# EAGLE design Remote (EAGLE 9.4.2)

## Sheet 1 of 3
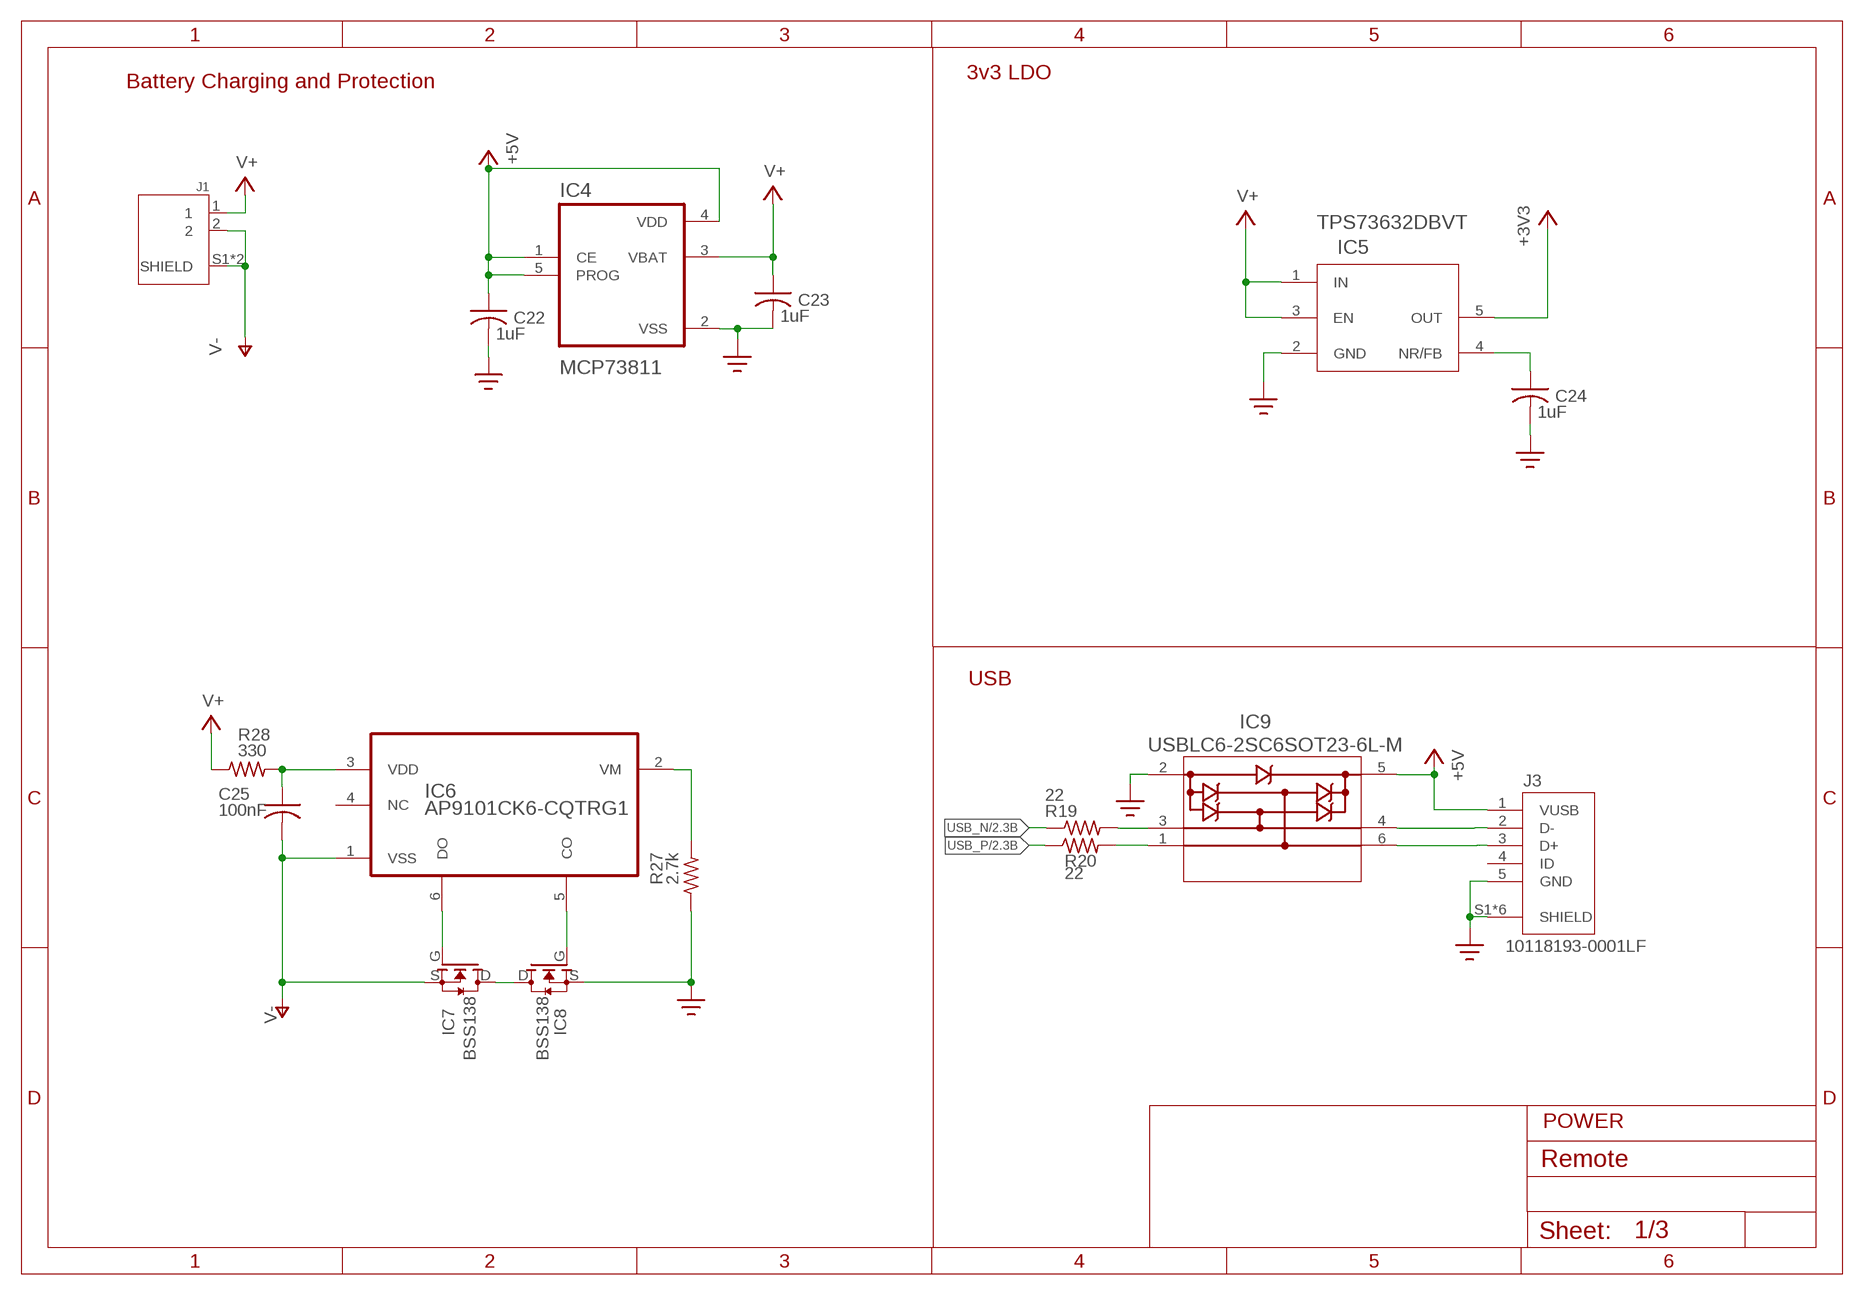
[diagram p0: schematic, sheet 1]

### Parts
C22  1uF  C-USC0805K  [C0805K]
C23  1uF  C-USC0805K  [C0805K]
C24  1uF  C-USC0805K  [C0805K]
C25  100nF  C-USC0805K  [C0805K]
IC4  MCP73811  MCP73811T-420I/OT  [SOT95P280X145-5N]
IC5  TPS73632DBVT  TPS73632DBVTDBV5-M  [DBV5-M]
IC6  AP9101CK6-CQTRG1  [SOT95P280X140-6N]
IC7  BSS138  [BSS138]
IC8  BSS138  [BSS138]
IC9  USBLC6-2SC6SOT23-6L-M  [SOT23-6L-M]
J1  S2B-PH-SM4-TB(LF)(SN)  [JST_S2B-PH-SM4-TB(LF)(SN)]
J3  10118193-0001LF  [FCI_10118193-0001LF]
R19  22  R-US_R0805W  [R0805W]
R20  22  R-US_R0805W  [R0805W]
R27  2.7k  R-US_R0805W  [R0805W]
R28  330  R-US_R0805W  [R0805W]

### Nets
+3V3 [Power]: IC5.5(OUT) ; also sheet 2,3
+5V [Power]: C22.1 IC4.1(CE) IC4.4(VDD) IC4.5(PROG) IC9.5(VBUS) J3.1(VUSB) ; also sheet 2
GND [Power]: C22.2 C23.2 C24.2 IC4.2(VSS) IC5.2(GND) IC8.S IC9.2(GND) J3.5(GND) J3.S1(SHIELD) J3.S2(SHIELD) J3.S3(SHIELD) J3.S4(SHIELD) J3.S5(SHIELD) J3.S6(SHIELD) R27.1 ; also sheet 2,3
N$29: IC6.6(DO) IC7.G
N$30: IC6.5(CO) IC8.G
N$31: IC7.D IC8.D
N$32: C24.1 IC5.4(NR/FB)
N$33: IC6.2(VM) R27.2
N$35: C25.1 IC6.3(VDD) R28.2
USB2_N [Differential]: IC9.4(I/O2) J3.2(D-)
USB2_P [Differential]: IC9.6(I/O1) J3.3(D+)
USB3_N [Differential]: IC9.3(I/O2_2) R19.2
USB3_P [Differential]: IC9.1(I/O1_2) R20.2
USB_N [Differential]: R19.1 ; also sheet 2
USB_P [Differential]: R20.1 ; also sheet 2
V+ [Power]: C23.1 IC4.3(VBAT) IC5.1(IN) IC5.3(EN) J1.1 R28.1 ; also sheet 2
V- [Power]: C25.2 IC6.1(VSS) IC7.S J1.2 J1.S1(SHIELD) J1.S2(SHIELD)
Unconnected: IC6.4(NC) J3.4(ID)

### Notes on the sheet
- 3v3 LDO
- Battery Charging and Protection
- USB
- POWER

## Sheet 2 of 3
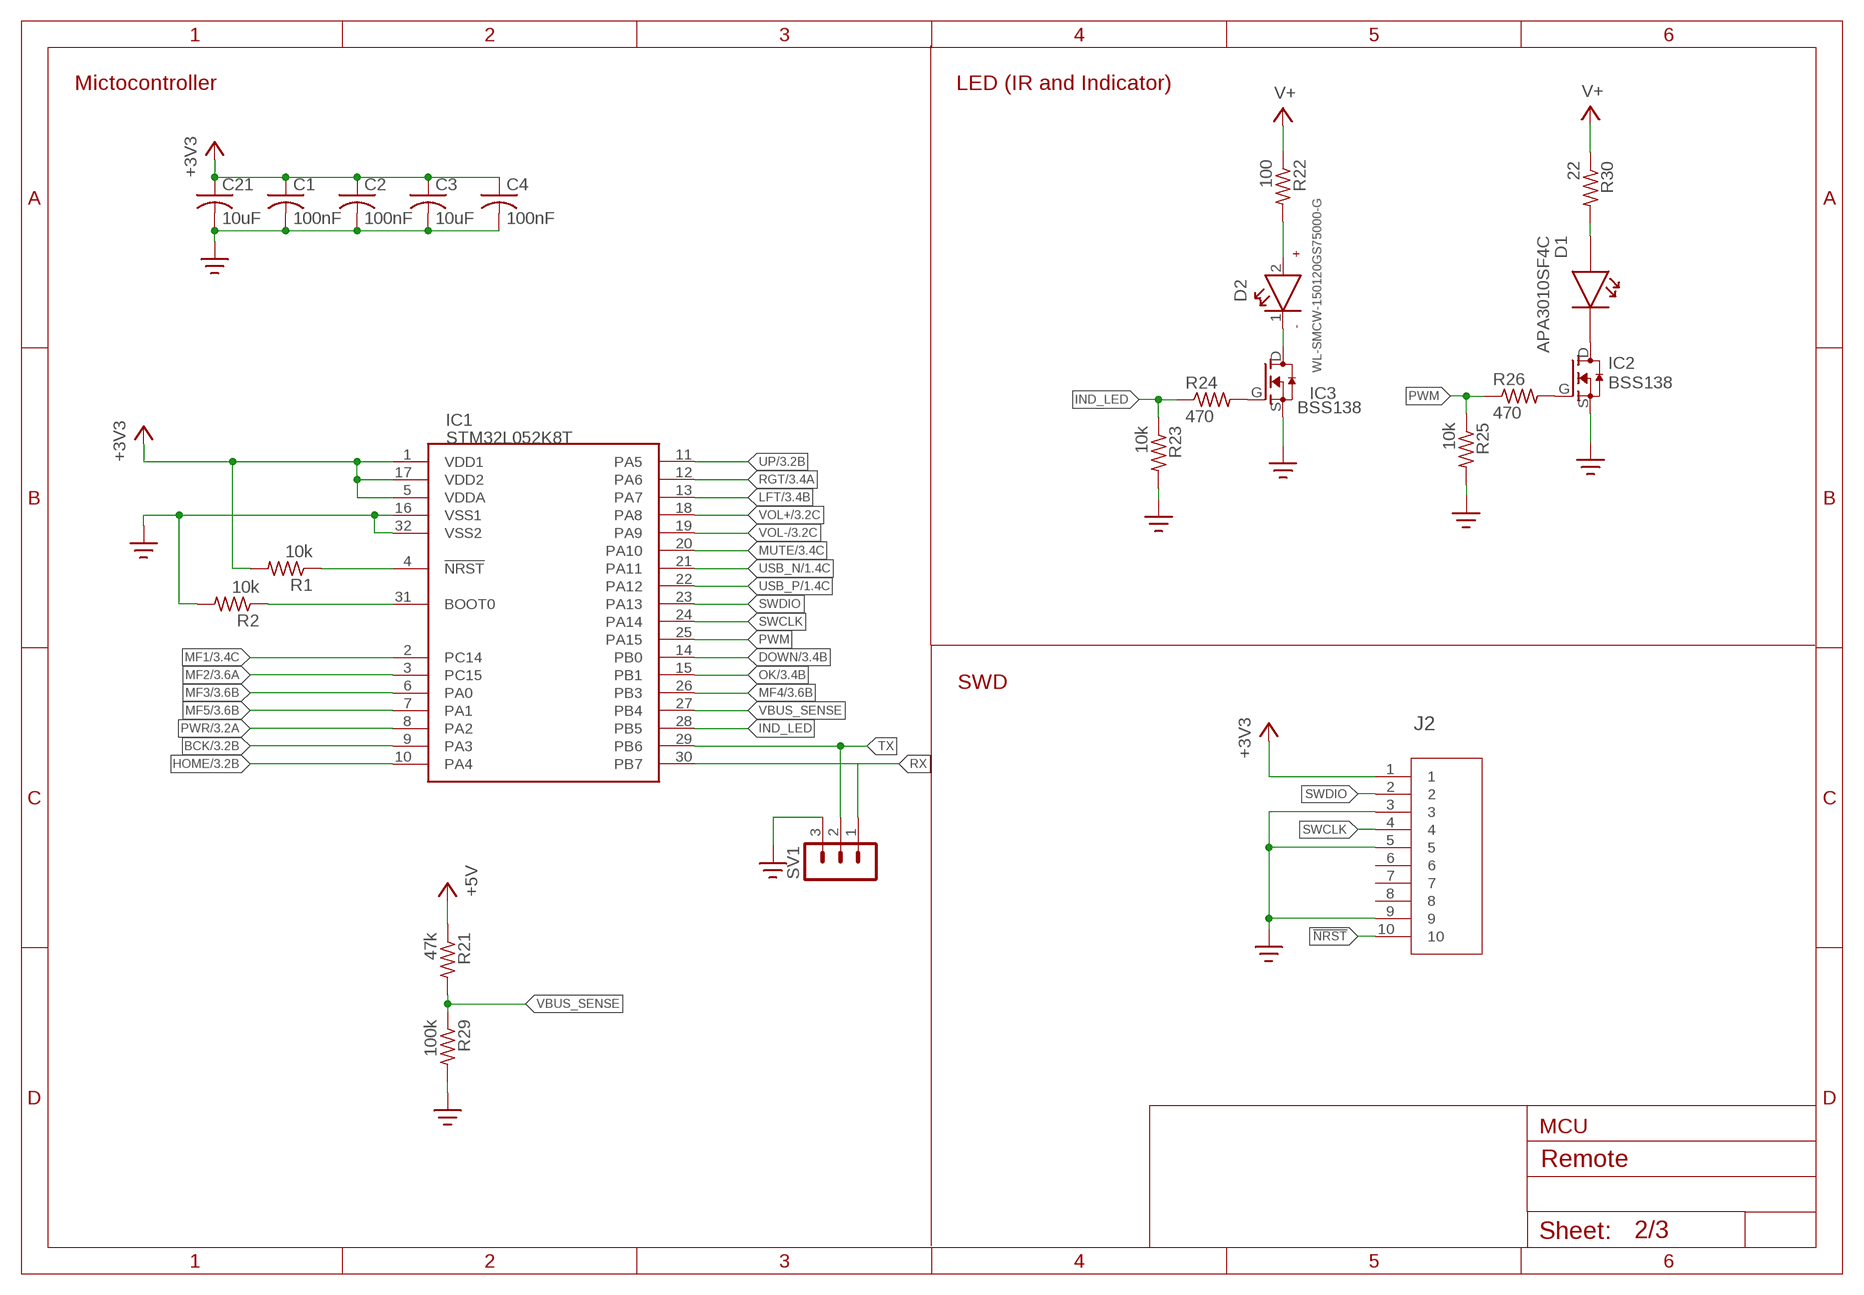
[diagram p1: schematic, sheet 2]

### Parts
C1  100nF  C-USC0805K  [C0805K]
C2  100nF  C-USC0805K  [C0805K]
C3  10uF  C-USC0805K  [C0805K]
C4  100nF  C-USC0805K  [C0805K]
C21  10uF  C-USC0805K  [C0805K]
D1  APA3010SF4C  [APA3010SF4C]
D2  WL-SMCW-150120GS75000-G  [WL-SMCW_1206]
IC1  STM32L052K8T  [QFP80P900X900X160-32N]
IC2  BSS138  [BSS138]
IC3  BSS138  [BSS138]
J2  20021121-00010C4LF  [CONN_00010C4LF_AMP]
R1  10k  R-US_R0805W  [R0805W]
R2  10k  R-US_R0805W  [R0805W]
R21  47k  R-US_R0805W  [R0805W]
R22  100  R-US_R0805W  [R0805W]
R23  10k  R-US_R0805W  [R0805W]
R24  470  R-US_R0805W  [R0805W]
R25  10k  R-US_R0805W  [R0805W]
R26  470  R-US_R0805W  [R0805W]
R29  100k  R-US_R0805W  [R0805W]
R30  22  R-US_R0805W  [R0805W]
SV1  MA03-1  [MA03-1]

### Nets
!NRST: IC1.4(!NRST) J2.10 R1.1
+3V3 [Power]: C1.1 C2.1 C3.1 C4.1 C21.1 IC1.1(VDD1) IC1.5(VDDA) IC1.17(VDD2) J2.1 R1.2 ; also sheet 1,3
+5V [Power]: R21.1 ; also sheet 1
BCK: IC1.9(PA3) ; also sheet 3
DOWN: IC1.14(PB0) ; also sheet 3
GND [Power]: C1.2 C2.2 C3.2 C4.2 C21.2 IC1.16(VSS1) IC1.32(VSS2) IC2.S IC3.S J2.3 J2.5 J2.9 R2.2 R23.2 R25.2 R29.2 SV1.3 ; also sheet 1,3
HOME: IC1.10(PA4) ; also sheet 3
IND_LED: IC1.28(PB5) R23.1 R24.1
LFT: IC1.13(PA7) ; also sheet 3
MF1: IC1.2(PC14) ; also sheet 3
MF2: IC1.3(PC15) ; also sheet 3
MF3: IC1.6(PA0) ; also sheet 3
MF4: IC1.26(PB3) ; also sheet 3
MF5: IC1.7(PA1) ; also sheet 3
MUTE: IC1.20(PA10) ; also sheet 3
N$2: D1.1 R30.2
N$3: IC1.31(BOOT0) R2.1
N$19: D1.2 IC2.D
N$23: D2.2(+) R22.2
N$24: D2.1(-) IC3.D
N$25: IC2.G R26.2
N$27: IC3.G R24.2
OK: IC1.15(PB1) ; also sheet 3
PWM: IC1.25(PA15) R25.1 R26.1
PWR: IC1.8(PA2) ; also sheet 3
RGT: IC1.12(PA6) ; also sheet 3
RX: IC1.30(PB7) SV1.1
SWCLK: IC1.24(PA14) J2.4
SWDIO: IC1.23(PA13) J2.2
TX: IC1.29(PB6) SV1.2
UP: IC1.11(PA5) ; also sheet 3
USB_N [Differential]: IC1.21(PA11) ; also sheet 1
USB_P [Differential]: IC1.22(PA12) ; also sheet 1
V+ [Power]: R22.1 R30.1 ; also sheet 1
VBUS_SENSE: IC1.27(PB4) R21.2 R29.1
VOL+: IC1.18(PA8) ; also sheet 3
VOL-: IC1.19(PA9) ; also sheet 3
Unconnected: J2.6 J2.7 J2.8

### Notes on the sheet
- Mictocontroller | LED (IR and Indicator)
- SWD
- MCU

## Sheet 3 of 3
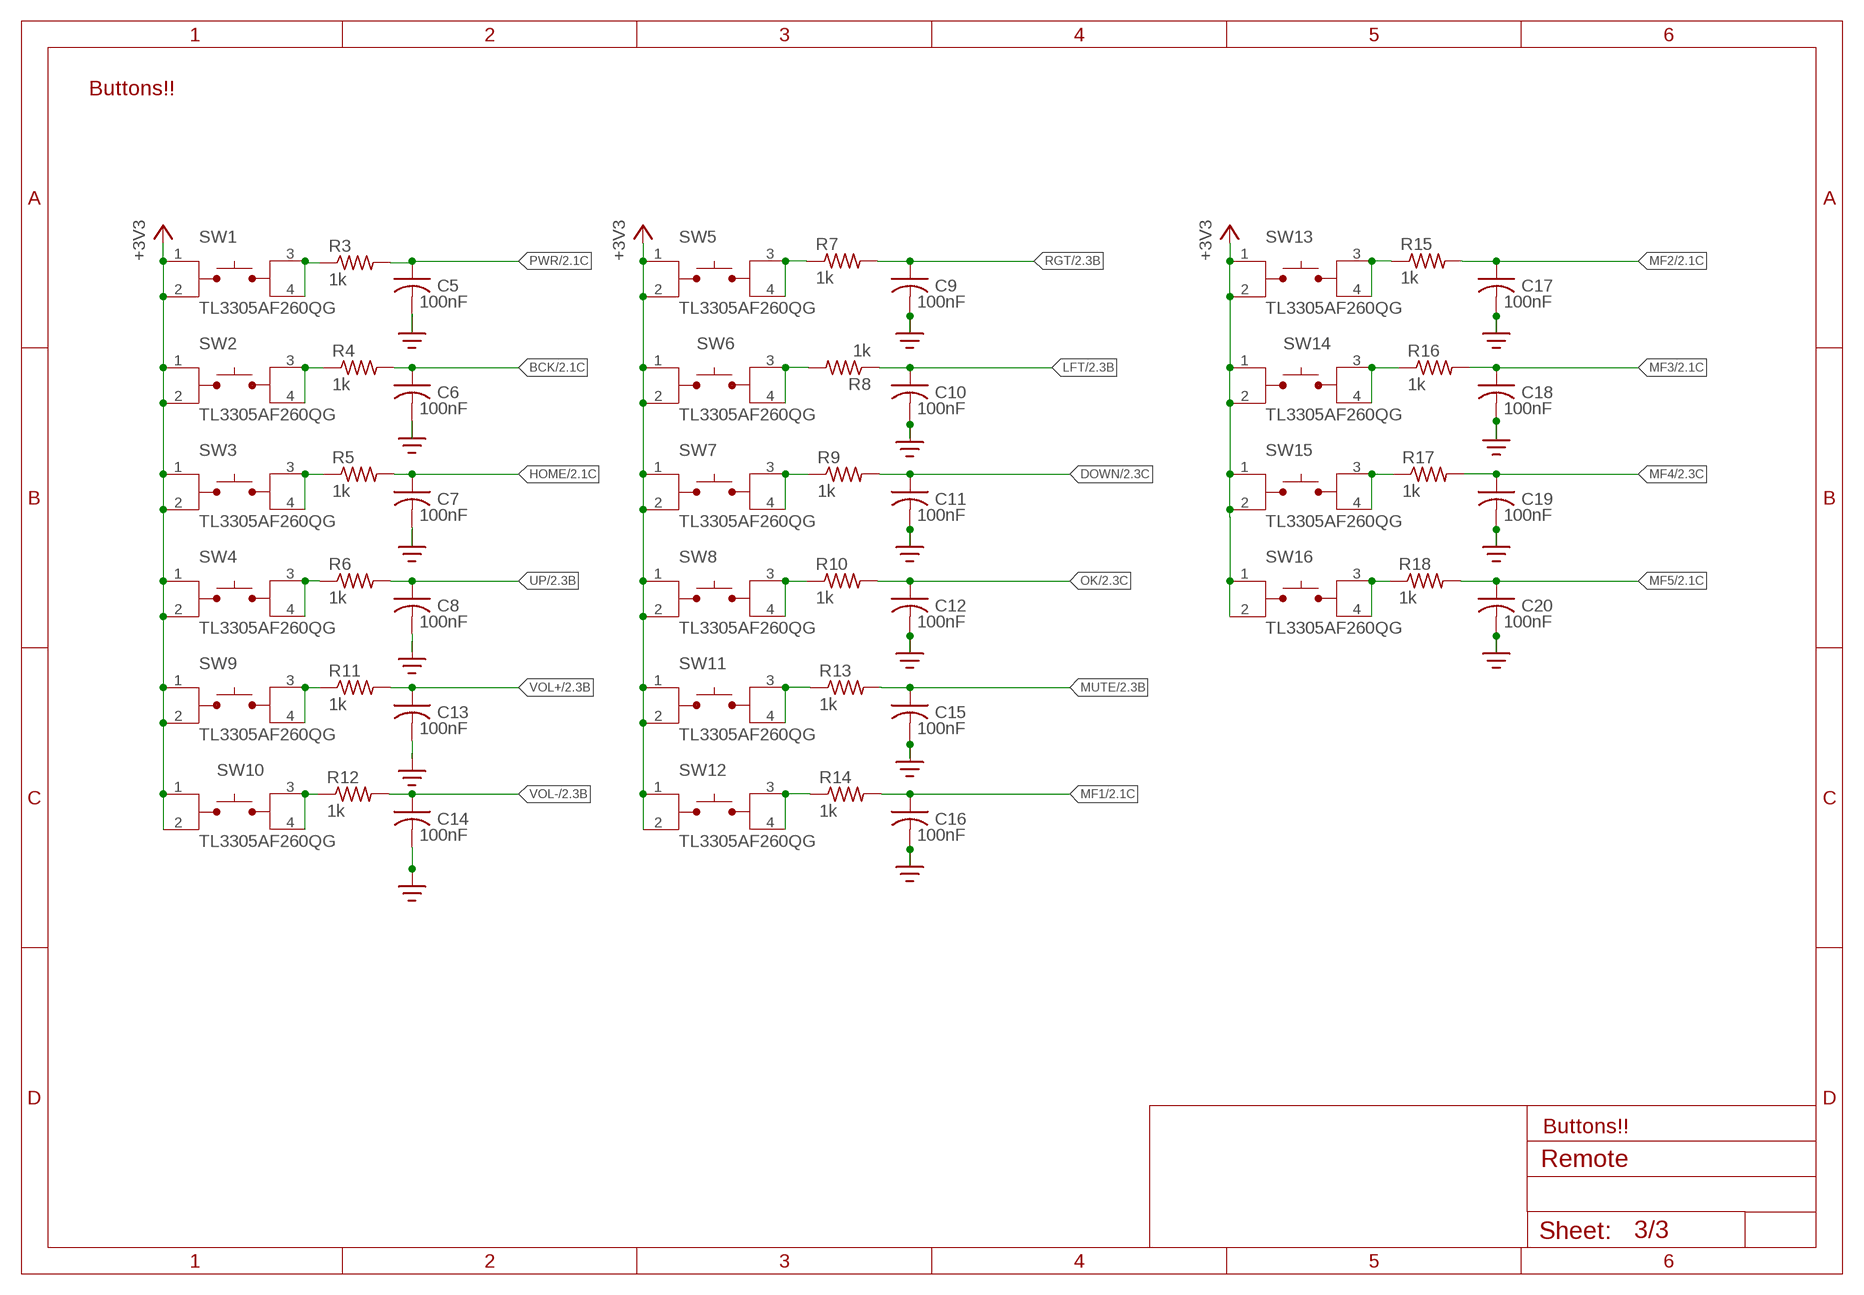
[diagram p2: schematic, sheet 3]

### Parts
C5  100nF  C-USC0805K  [C0805K]
C6  100nF  C-USC0805K  [C0805K]
C7  100nF  C-USC0805K  [C0805K]
C8  100nF  C-USC0805K  [C0805K]
C9  100nF  C-USC0805K  [C0805K]
C10  100nF  C-USC0805K  [C0805K]
C11  100nF  C-USC0805K  [C0805K]
C12  100nF  C-USC0805K  [C0805K]
C13  100nF  C-USC0805K  [C0805K]
C14  100nF  C-USC0805K  [C0805K]
C15  100nF  C-USC0805K  [C0805K]
C16  100nF  C-USC0805K  [C0805K]
C17  100nF  C-USC0805K  [C0805K]
C18  100nF  C-USC0805K  [C0805K]
C19  100nF  C-USC0805K  [C0805K]
C20  100nF  C-USC0805K  [C0805K]
R3  1k  R-US_R0805W  [R0805W]
R4  1k  R-US_R0805W  [R0805W]
R5  1k  R-US_R0805W  [R0805W]
R6  1k  R-US_R0805W  [R0805W]
R7  1k  R-US_R0805W  [R0805W]
R8  1k  R-US_R0805W  [R0805W]
R9  1k  R-US_R0805W  [R0805W]
R10  1k  R-US_R0805W  [R0805W]
R11  1k  R-US_R0805W  [R0805W]
R12  1k  R-US_R0805W  [R0805W]
R13  1k  R-US_R0805W  [R0805W]
R14  1k  R-US_R0805W  [R0805W]
R15  1k  R-US_R0805W  [R0805W]
R16  1k  R-US_R0805W  [R0805W]
R17  1k  R-US_R0805W  [R0805W]
R18  1k  R-US_R0805W  [R0805W]
SW1  TL3305AF260QG  [SW_TL3305AF260QG]
SW2  TL3305AF260QG  [SW_TL3305AF260QG]
SW3  TL3305AF260QG  [SW_TL3305AF260QG]
SW4  TL3305AF260QG  [SW_TL3305AF260QG]
SW5  TL3305AF260QG  [SW_TL3305AF260QG]
SW6  TL3305AF260QG  [SW_TL3305AF260QG]
SW7  TL3305AF260QG  [SW_TL3305AF260QG]
SW8  TL3305AF260QG  [SW_TL3305AF260QG]
SW9  TL3305AF260QG  [SW_TL3305AF260QG]
SW10  TL3305AF260QG  [SW_TL3305AF260QG]
SW11  TL3305AF260QG  [SW_TL3305AF260QG]
SW12  TL3305AF260QG  [SW_TL3305AF260QG]
SW13  TL3305AF260QG  [SW_TL3305AF260QG]
SW14  TL3305AF260QG  [SW_TL3305AF260QG]
SW15  TL3305AF260QG  [SW_TL3305AF260QG]
SW16  TL3305AF260QG  [SW_TL3305AF260QG]

### Nets
+3V3 [Power]: SW1.1 SW1.2 SW2.1 SW2.2 SW3.1 SW3.2 SW4.1 SW4.2 SW5.1 SW5.2 SW6.1 SW6.2 SW7.1 SW7.2 SW8.1 SW8.2 SW9.1 SW9.2 SW10.1 SW10.2 SW11.1 SW11.2 SW12.1 SW12.2 SW13.1 SW13.2 SW14.1 SW14.2 SW15.1 SW15.2 SW16.1 SW16.2 ; also sheet 1,2
BCK: C6.1 R4.2 ; also sheet 2
DOWN: C11.1 R9.2 ; also sheet 2
GND [Power]: C5.2 C6.2 C7.2 C8.2 C9.2 C10.2 C11.2 C12.2 C13.2 C14.2 C15.2 C16.2 C17.2 C18.2 C19.2 C20.2 ; also sheet 1,2
HOME: C7.1 R5.2 ; also sheet 2
LFT: C10.1 R8.1 ; also sheet 2
MF1: C16.1 R14.2 ; also sheet 2
MF2: C17.1 R15.2 ; also sheet 2
MF3: C18.1 R16.2 ; also sheet 2
MF4: C19.1 R17.2 ; also sheet 2
MF5: C20.1 R18.2 ; also sheet 2
MUTE: C15.1 R13.2 ; also sheet 2
N$1: R3.1 SW1.3 SW1.4
N$4: R4.1 SW2.3 SW2.4
N$5: R5.1 SW3.3 SW3.4
N$6: R6.1 SW4.3 SW4.4
N$7: R11.1 SW9.3 SW9.4
N$8: R12.1 SW10.3 SW10.4
N$9: R7.1 SW5.3 SW5.4
N$10: R8.2 SW6.3 SW6.4
N$11: R9.1 SW7.3 SW7.4
N$12: R10.1 SW8.3 SW8.4
N$13: R13.1 SW11.3 SW11.4
N$14: R14.1 SW12.3 SW12.4
N$15: R15.1 SW13.3 SW13.4
N$16: R16.1 SW14.3 SW14.4
N$17: R17.1 SW15.3 SW15.4
N$18: R18.1 SW16.3 SW16.4
OK: C12.1 R10.2 ; also sheet 2
PWR: C5.1 R3.2 ; also sheet 2
RGT: C9.1 R7.2 ; also sheet 2
UP: C8.1 R6.2 ; also sheet 2
VOL+: C13.1 R11.2 ; also sheet 2
VOL-: C14.1 R12.2 ; also sheet 2

### Notes on the sheet
- Buttons!!
- Buttons!!

## Library data of the parts
C1-C25 = rcl:C-US: CAPACITOR, American symbol; SPICEPREFIX: C
D1 = APA3010SF4C:APA3010SF4C: DIO-10854 Right-angle 880nm SMT infrared LED; DESCRIPTION: Infrared _IR_ Emitter 880nm 1.3V 50mA 0.4mW/sr @ 20mA 120° 2-SMD, No Lead; DIGI-KEY_PART_NUMBER: 754-1070-1-ND; DIGI-KEY_PURCHASE_URL: https://www.digikey.com/product-detail/en/kingbright/APA3010SF4C/754-1070-1-ND/1747787?utm_source=snapeda&utm_medium=aggregator&utm_campaign=symbol; MF: Kingbright; MP: APA3010SF4C; PACKAGE: SMD-2 Kingbright
D2 = WL-SMCW:WL-SMCW: SMD mono-color Chip LED Characteristics Low energy consumption High reliability Low current requirement Fast switching No UV/IR radiation Smallest SMD package with exceptional brightness Top view Wide viewing angle PBC high-usage Applications Backlight for mobile and portable device keypads Indoor and outdoor message boards Flat backlight for LCDs, switches and symbols Display for industrial control systems and traffic Miniaturized color effects Pedestrian mark Optical indicators General lighting Toys <http://katalog.we-online.de/media/images/eipal/WL-SMCW_pf2.jpg> Details see: http://katalog.we-online.de/en/led/WL-SMCW?m Updated 2015-04-10 2015 (C) Wurth Elektronik; AVAILABILITY: Unavailable; DESCRIPTION: Green 570nm LED Indication - Discrete 2V 0603 _1608 Metric_; MF: Wurth Electronics; MP: 150060VS75000; PACKAGE: 0603 Wurth Electronics; PRICE: None
IC1 = QFP80P900X900X160-32N:STM32L052K8T
IC2 IC3 IC7 IC8 = BSS138:BSS138: BSS138 N-Channel Logic Level Enhancement Mode Field Effect Transistor; AVAILABILITY: Unavailable; DESCRIPTION: N-Channel 50V 220mA _Ta_ 360mW _Ta_ Surface Mount SOT-23-3; MF: MICROSS/On Semiconductor; MP: BSS138; PACKAGE: TO-236-3 Micross; PRICE: None
IC4 = MCP73811T-420I_OT:MCP73811T-420I/OT; DESCRIPTION: Charger IC Lithium Ion/Polymer SOT-23-5; DIGI-KEY_PART_NUMBER: MCP73811T-420I/OTCT-ND; DIGI-KEY_PURCHASE_URL: https://www.digikey.com/product-detail/en/microchip-technology/MCP73811T-420I-OT/MCP73811T-420I-OTCT-ND/1649474?utm_source=snapeda&utm_medium=aggregator&utm_campaign=symbol; MF: Microchip; MP: MCP73811T-420I/OT; PACKAGE: SOT-23 Microchip
IC5 = Remote:TPS73632DBVT; BUILT_BY: EMA_UL_Team; MANUFACTURER: Texas Instruments; MANUFACTURER_PART_NUMBER: TPS73632DBVT; VENDOR: Texas Instruments
IC6 = AP9101CK6-CQTRG1:AP9101CK6-CQTRG1: None; AVAILABILITY: Unavailable; DESCRIPTION: Battery Battery Protection IC Lithium Ion/Polymer SOT-26; MF: Diodes Inc.; MP: AP9101CK6-CQTRG1; PACKAGE: SOT-23 Diodes Inc.; PRICE: None
IC9 = Remote:USBLC6-2SC6; BUILT_BY: EMA_UL_Team; MANUFACTURER_PART_NUMBER: USBLC6-2SC6; VENDOR: STMicroelectronics
J1 = S2B-PH-SM4-TB_LF__SN_:S2B-PH-SM4-TB(LF)(SN): PH Series 2 Position 2 mm Pitch Surface Mount Side Entry Shrouded Header; AVAILABILITY: Unavailable; DESCRIPTION: Connector Header Surface Mount, Right Angle 2 position 0.079 _2.00mm_; MF: JST Sales; MP: S2B-PH-SM4-TB_LF__SN_; PACKAGE: None; PRICE: None
J2 = Remote:20021121-00010C4LF; BUILT_BY: EMA_Matt; COPYRIGHT: Copyright (C) 2018 Accelerated Designs. All rights reserved; MANUFACTURER_PART_NUMBER: 20021121-00010C4LF; SOURCELIBRARY: Amphenol_2019-10-30; VENDOR: Amphenol
J3 = 10118193-0001LF:10118193-0001LF: Micro USB B Type Receptacle; DESCRIPTION: USB - micro B USB 2.0 Receptacle Connector 5 Position Surface Mount, Right Angle; Through Hole; DIGI-KEY_PART_NUMBER: 609-4616-1-ND; DIGI-KEY_PURCHASE_URL: https://www.digikey.com/product-detail/en/amphenol-icc-fci/10118193-0001LF/609-4616-1-ND/2785380?utm_source=snapeda&utm_medium=aggregator&utm_campaign=symbol; MF: Amphenol ICC; MP: 10118193-0001LF; PACKAGE: None
R1-R30 = Controller:R-US_: RESISTOR, American symbol; SPICEPREFIX: R
SV1 = con-lstb:MA03-1: PIN HEADER; OC_FARNELL: unknown; OC_NEWARK: unknown
SW1-SW16 = TL3305AF260QG:TL3305AF260QG: Switch Tactile Spst-No 50ma 12v; DESCRIPTION: Tactile Switch SPST-NO Top Actuated Surface Mount; DIGI-KEY_PART_NUMBER: EG5353CT-ND; DIGI-KEY_PURCHASE_URL: https://www.digikey.com/product-detail/en/e-switch/TL3305AF260QG/EG5353CT-ND/5816198?utm_source=snapeda&utm_medium=aggregator&utm_campaign=symbol; MF: E-Switch; MP: TL3305AF260QG; PACKAGE: LQFP-48 E-Switch

## Net classes
1 Differential: width 0.406 mm, clearance 0.203 mm
2 Power: width 0.508 mm, clearance 0.203 mm

## Board
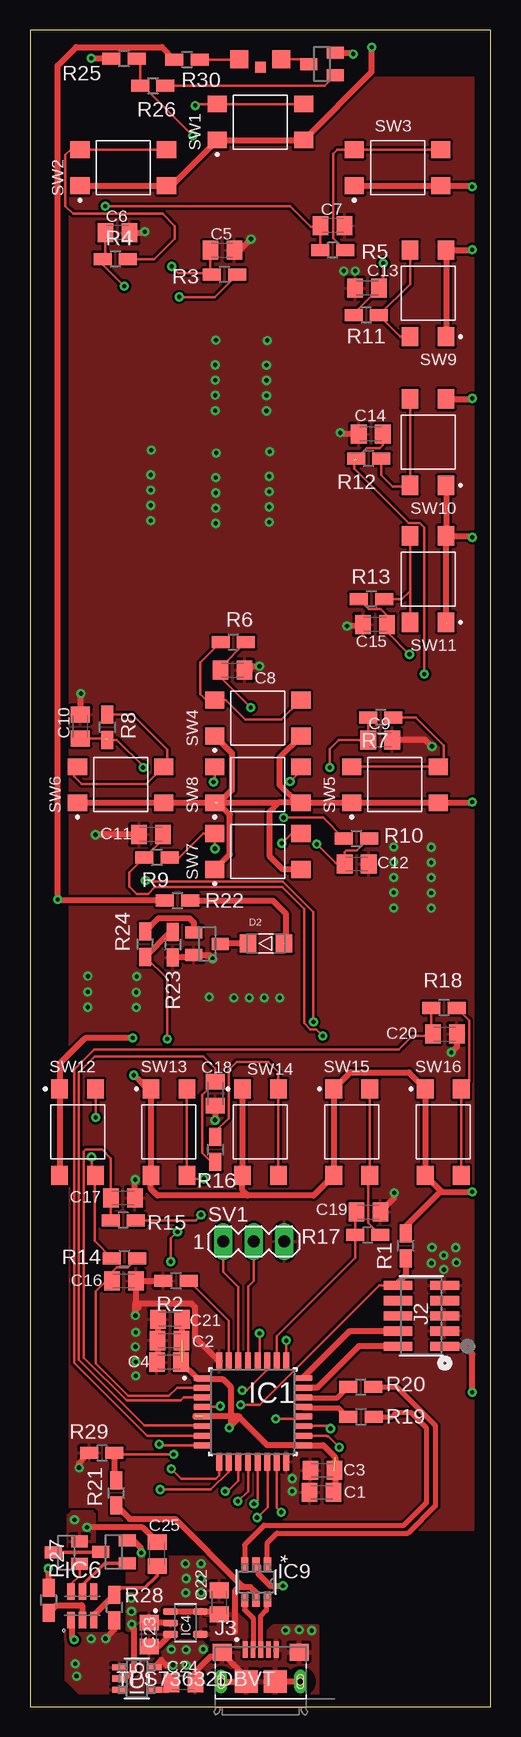
[diagram p3: board, top side]
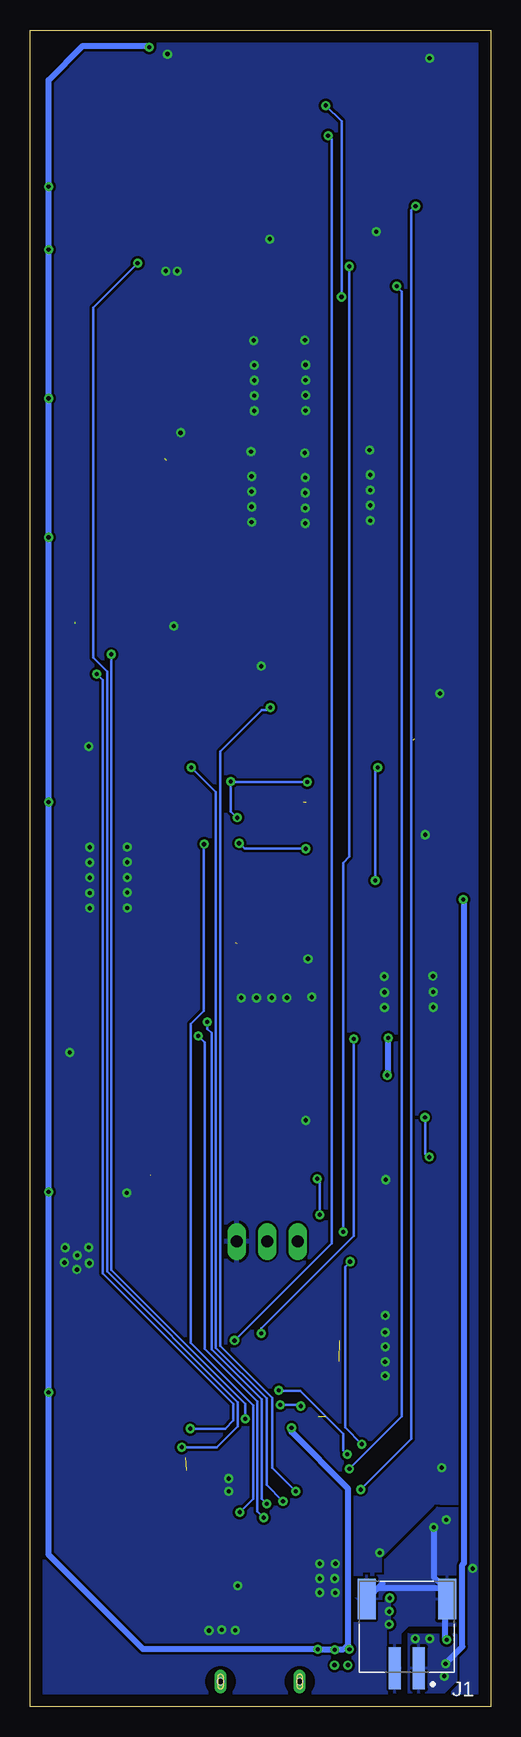
[diagram p4: board, bottom side, seen from below]

Size 38.4 x 139.78 mm. Coordinates in mm from the lower left corner, seen from the top.
Outline: 0.03,0 38.4,0.03 38.38,139.78 0,139.75 0.03,0
Copper layers (1*16): Top 0.035mm / dielectric 1.5mm / Bottom 0.035mm
Design rules "default": minimum track width 6mil, minimum drill 0.35mm, track to track 6mil, track to pad 6mil, pad to pad 6mil, via to via 6mil, smd to smd 6mil, copper to edge 40mil, drill to drill 6mil, minimum pad ring 10mil, minimum via ring 8mil, stop-mask expansion 4mil, vias tented up to drill 0mil, thermal gap 10mil

### Footprints (pad centres in the part's own frame; a part is rotated, then mirrored left to right if it is on the bottom)
C0805K = smd 1.3 x 1.6: 1 -1,0; 2 1,0
APA3010SF4C = smd 1.5 x 1.5: 1 0,-1.75; 2 0,1.75 | smd 0.9 x 0.9: 3 0.65,0
WL-SMCW_1206 = smd 1.4 x 1.5: 1 -1.5,0; 2 1.5,0
QFP80P900X900X160-32N = smd 1.56 x 0.55: 1 -4.18,2.8; 2 -4.18,2; 3 -4.18,1.2; 4 -4.18,0.4; 5 -4.18,-0.4; 6 -4.18,-1.2; 7 -4.18,-2; 8 -4.18,-2.8; 17 4.18,-2.8; 18 4.18,-2; 19 4.18,-1.2; 20 4.18,-0.4; 21 4.18,0.4; 22 4.18,1.2; 23 4.18,2; 24 4.18,2.8 | smd 0.55 x 1.56: 9 -2.8,-4.18; 10 -2,-4.18; 11 -1.2,-4.18; 12 -0.4,-4.18; 13 0.4,-4.18; 14 1.2,-4.18; 15 2,-4.18; 16 2.8,-4.18; 25 2.8,4.18; 26 2,4.18; 27 1.2,4.18; 28 0.4,4.18; 29 -0.4,4.18; 30 -1.2,4.18; 31 -2,4.18; 32 -2.8,4.18
BSS138 = smd 1 x 1.4: D 0,1.1; G -0.95,-1.1; S 0.95,-1.1
SOT95P280X145-5N = smd 1.22 x 0.6: 1 -1.245,0.95; 2 -1.245,0; 3 -1.245,-0.95; 4 1.245,-0.95; 5 1.245,0.95
DBV5-M = smd 1.181 x 0.508: 1 -1.467,0.95; 2 -1.467,0; 3 -1.467,-0.95; 4 1.467,-0.95; 5 1.467,0.95
SOT95P280X140-6N = smd 1.35 x 0.6: 1 -1.185,0.95; 2 -1.185,0; 3 -1.185,-0.95; 4 1.185,-0.95; 5 1.185,0; 6 1.185,0.95
SOT23-6L-M = smd 1.181 x 0.61: 1 -1.467,0.95; 2 -1.467,0; 3 -1.467,-0.95; 4 1.467,-0.95; 5 1.467,0; 6 1.467,0.95
JST_S2B-PH-SM4-TB(LF)(SN) = smd 1 x 3.5: 1 -1,0; 2 1,0 | smd 1.5 x 3.4: S1 -3.35,-5.75; S2 3.35,-5.75
CONN_00010C4LF_AMP = smd 0.762 x 2.388: 1 -2.54,-1.95; 2 -2.54,1.95; 3 -1.27,-1.95; 4 -1.27,1.95; 5 0,-1.95; 6 0,1.95; 7 1.27,-1.95; 8 1.27,1.95; 9 2.54,-1.95; 10 2.54,1.95
FCI_10118193-0001LF = smd 0.4 x 1.35: 1 -1.3,2.675; 2 -0.65,2.675; 3 0,2.675; 4 0.65,2.675; 5 1.3,2.675 | smd 1.6 x 1.4: S1 -3.2,2.45; S2 3.2,2.45 | smd 1.9 x 1.9: S3 1.2,0; S4 -1.2,0 | drill 0.5 pad 0.9 long: S5 -3.3,0; S6 3.3,0 | hole 0.5: -3.3,0; 3.3,0
R0805W = smd 1.5 x 1: 1 -1.052,0; 2 1.052,0
MA03-1 = drill 1.016 long: 1 -2.54,0; 2 0,0; 3 2.54,0
SW_TL3305AF260QG = smd 1.4 x 1.6: 1 -1.5,3.6; 2 -1.5,-3.6; 3 1.5,3.6; 4 1.5,-3.6

### Placement (x,y rotation side)
C1  24.31,17.88 180 top
C2  11.63,30.53 180 top
C3  24.36,19.71 180 top
C4  11.58,28.73 180 top
C5  16.03,121.41 0 top
C6  7.29,122.89 0 top
C7  25.22,123.47 0 top
C8  16.89,86.41 0 top
C9  29.18,80.59 0 top
C10  4.19,81.71 90 top
C11  10.08,72.72 180 top
C12  27.23,70.26 0 top
C13  28.09,118.26 180 top
C14  28.4,106.1 180 top
C15  28.75,90.22 180 top
C16  7.82,35.51 0 top
C17  7.75,42.42 0 top
C18  15.44,51.1 270 top
C19  28.19,41.25 0 top
C20  34.57,56.08 0 top
C21  11.66,32.31 180 top
C22  15.77,8.71 90 top
C23  9.93,6.02 90 top
C24  12.78,2.01 0 top
C25  10.59,12.75 90 top
D1  19.2,137.33 270 top
D2  19.66,63.63 0 top
IC1  18.57,24.6 0 top
IC2  24.33,136.94 90 top
IC3  14.76,63.6 270 top
IC4  12.95,7 0 top
IC5  8.91,2.36 0 top
IC6  4.37,8.42 90 top
IC7  3.03,12.86 90 top
IC8  6.99,12.91 90 top
IC9  18.84,10.4 270 top
J1  7,3.23 180 bottom
J2  32.61,32.59 90 top
J3  19.23,2.11 0 top
R1  31.32,38.43 90 top
R2  12.17,35.51 180 top
R3  16.21,119.38 180 top
R4  7.11,120.68 180 top
R5  25.22,121.41 180 top
R6  16.94,88.75 0 top
R7  29.24,82.47 180 top
R8  6.45,81.66 90 top
R9  10.59,70.79 180 top
R10  27.2,72.39 0 top
R11  28.02,116 180 top
R12  28.22,104.04 180 top
R13  28.45,92.33 180 top
R14  7.87,37.39 0 top
R15  7.77,40.56 180 top
R16  15.44,46.46 270 top
R17  28.14,39.32 180 top
R18  34.49,58.27 180 top
R19  27.59,24.19 0 top
R20  27.56,26.68 0 top
R21  7.19,17.83 90 top
R22  12.29,67.21 0 top
R23  11.89,63.53 270 top
R24  9.6,63.58 90 top
R25  7.82,137.39 180 top
R26  10.24,135.13 0 top
R27  1.55,8.89 270 top
R28  7.04,8.28 90 top
R29  5.99,21.16 180 top
R30  13.09,137.31 0 top
SV1  18.64,38.79 0 top
SW1  19.2,132.11 90 top
SW2  7.77,128.3 90 top
SW3  30.63,128.3 90 top
SW4  18.99,82.43 90 top
SW5  30.42,76.87 90 top
SW6  7.56,76.87 90 top
SW7  18.99,71.3 90 top
SW8  18.99,76.87 90 top
SW9  33.17,117.82 180 top
SW10  33.17,105.42 180 top
SW11  33.17,94.01 180 top
SW12  3.96,47.9 0 top
SW13  11.58,47.9 0 top
SW14  19.2,47.9 0 top
SW15  26.82,47.9 0 top
SW16  34.44,47.9 0 top

### Tracks (layer width: path | path; a pad name or v marks a point on that pad's centre or on a via)
!NRST  (via drill 0.35)
  Top 0.203: J2.10 30.45,35.13 29.09,35.13 19.13,25.17 v17.55,25.17 | v15.85,25.07 15.79,25 IC1.4
  Top 0.508: R1.1 31.32,35.99 30.45,35.13
  Bottom 0.203: v17.55,25.17 15.95,25.17 v15.85,25.07
+3V3  (via drill 0.35)  (5 unrouted)
  Top 0.508: IC5.5 10.95,3.89 11.39,3.45 11.89,3.45 v11.91,3.48 | 17.42,24.13 19.75,21.8 IC1.17 24.43,21.8 25.43,20.8 25.43,18 C1.1 | 13.77,24.21 17.45,24.21 17.48,24.18 17.42,24.13 | IC1.1 14.46,27.33 | 14.46,27.33 16.05,27.33 16.71,26.67 16.71,23.42 | v16.61,23.27 16.61,23.32 16.71,23.42 | 16.71,23.42 17.42,24.13 | 14.46,27.33 13.98,27.33 C4.1 12.66,28.8 C21.1 | v36.86,26.21 36.86,29.41 36.22,30.05 J2.1 | SW9.1 SW9.2 36.81,121.42 v36.86,121.46 | 35,89.97 34.67,90.3 | SW3.2 34.67,126.36 | SW3.1 SW3.2 | SW2.1 SW2.2 11.79,126.8 SW1.1 SW1.2 28.47,136.28 v28.47,138.33 | SW3.2 36.78,126.8 v36.86,126.72 | SW10.2 36.81,109.02 v36.86,109.07 | SW11.2 36.74,97.61 v36.86,97.49 | SW6.1 SW6.2 15.65,75.37 | 15.65,75.37 15.78,75.37 | 15.78,75.37 20.7,75.37 | SW7.1 16.66,71.08 16.66,74.35 15.65,75.37 | SW7.2 21.06,69.8 19.99,70.88 19.99,74.65 20.7,75.37 | SW8.2 22.25,75.37 20.78,76.84 20.78,79.12 SW4.2 | SW4.1 16.81,79.5 16.81,76.4 15.78,75.37 | SW8.2 SW5.1 SW5.2 36.81,75.37 v36.86,75.41 | SW12.2 SW12.1 2.46,53.62 4.6,55.75 v8.56,55.75 | SW14.1 SW14.2 17.7,43.05 18.14,42.62 | 34.32,42.92 SW16.2 SW16.1 31.56,52.88 26.7,52.88 SW15.1 SW15.2 23.64,42.62 18.14,42.62 | 34.32,42.92 v36.86,42.92 | 18.14,42.62 10.62,42.62 10.08,43.16 SW13.2 SW13.1 9.79,51.5 v8.64,52.65 | R1.2 31.32,40.07 34.17,42.92 34.32,42.92 | SW10.1 SW11.2 | SW11.1 SW11.2 | SW8.2 20.7,75.37
  Bottom 0.508: v16.61,23.27 16.61,22.91 11.89,18.19 11.89,5.18 12.27,4.8 v14.43,4.8 28.98,4.8 36.86,12.68 v36.86,26.21 v36.86,42.92 v36.86,75.41 v36.86,97.49 v36.86,109.07 v36.86,121.46 v36.86,126.72 36.86,135.61 34.04,138.43 28.58,138.43 v28.47,138.33 | v8.64,52.65 8.56,52.73 v8.56,55.75
  other vias: 13.03,3.48 11.79,4.8 13,4.75
  pour Top: 11.71,5.38 10.79,4.47 10.79,3.61 11.18,3.23 12.22,3.23 13.77,3.23 14.78,4.24 14.78,5.08 14.3,5.56 11.89,5.56
+5V
  Top 0.508: IC4.1 IC4.5 15.54,7.95 C22.1 | 17.65,9.98 18.38,9.98 18.88,9.49 18.88,8.98 IC9.5 | 17.65,9.98 17.4,9.98 17.07,9.66 17.07,6.25 | R21.1 8.29,15.67 12.09,15.67 17.65,10.11 17.65,9.98
  pour Top (rank 3): 14.27,8.1 14.27,3.88 18.28,3.88 18.24,6.71 18.21,6.71 16.86,8.06
BCK  (via drill 0.35)
  Top 0.203: v11.79,19.84 12.6,19.02 15.49,19.02 15.77,19.3 IC1.9 | C6.1 6.29,120.68 R4.2 6.06,120.2 v7.85,118.41
  Bottom 0.203: v11.79,19.84 7.42,24.21 7.42,117.98 v7.85,118.41
DOWN  (via drill 0.35)
  Top 0.203: v18.92,15.77 19.79,16.64 19.79,20.4 IC1.14 | v24.38,55.93 23.85,56.47 23.36,56.47 22.83,56.99 22.83,66.5 21.01,68.33 10.41,68.33 9.86,67.77 8.89,67.77 8.28,68.38 8.28,69.53 R9.2 11.08,72.33 C11.1
  Bottom 0.203: v24.38,55.93 23.85,55.4 23.85,29.84 19.46,25.45 19.46,16.31 v18.92,15.77
GND  (via drill 0.35)
  Top 0.508: J3.S5 J3.S4 18.03,2.46 16.29,4.2 | J3.S6 J3.S3 | IC4.2 11.69,7.02 C23.2 | IC5.2 7.68,2.6 8.22,2.6 8.66,3.04 8.66,6.48 8.36,6.78 8.38,6.78 v8.48,6.88 | J3.S1 16.39,4.2 16.29,4.2 | C24.2 13.78,2.92 15.05,4.2 16.29,4.2 | R27.1 1.55,11.25 1.42,11.38 1.42,11.46 1.5,11.53 v1.52,11.53 | IC9.2 19.03,11.68 19.03,11.09 20.03,10.08 v21.08,10.08 | IC1.32 13.77,30.78 13.77,33.3 13.46,33.6 8.74,33.6 8.74,32.99 | 8.74,32.99 8.74,32.66 v8.79,32.61 | IC8.S 8.6,13.86 9.26,13.2 v9.26,12.84 | R23.2 13.48,62.47 IC3.S 14.94,62.65 v15.24,62.35 | R29.2 4.09,20.31 v4.09,19.94 | R25.2 5.13,137.39 v5.11,137.41 | C20.2 35.57,55.83 | 35.57,55.83 35.57,55.03 v35.1,54.56 | 35.62,55.88 35.57,55.83 | 33.46,80.06 32.93,80.59 C9.2 | C8.2 18.22,86.74 v19.13,86.74 | 9.03,33.29 8.82,33.08 | C10.2 4.24,82.76 v4.24,84.46 | IC2.S 26.83,137.89 v26.95,137.77 | C5.2 17.48,121.41 v18.42,122.35 | C6.2 9.47,122.89 v9.55,122.96 | C14.2 25.96,106.1 v25.86,106.2 | C15.2 27.63,90.09 v26.42,90.09 | C11.2 5.49,72.72 v5.46,72.69 | R2.2 C16.2 8.82,33.08 | 8.82,33.08 8.74,32.99 | C21.2 10.66,30.56 C2.2 10.63,28.78 C4.2 | C17.2 8.75,43.93 v8.76,43.94 | C18.2 15.44,48.92 v15.42,48.9 | C19.2 30.35,42.41 v30.35,42.85
  other vias: 22.43,6.41 21.3,6.38 23.49,6.36 8.46,7.95 8.43,9.07 8.81,31.22 8.79,30.02 8.81,28.75 8.81,27.58 21.84,19.02 21.84,17.96 33.5,38.3 34.47,37.64 35.53,37.03 35.48,38.28 33.45,36.98 34.49,36.45 12.95,11.94 14.25,11.94 13,10.69 14.25,10.69 12.98,9.5 14.25,9.52 26.14,119.68 27.1,119.68 30.3,71.68 30.3,70.41 30.3,69.14 30.3,67.87 30.3,66.6 33.43,71.65 33.43,70.38 33.43,69.11 33.43,67.84 33.43,66.57 4.83,60.91 4.8,59.59 4.8,58.32 8.89,60.88 8.86,59.56 8.86,58.29 33.5,80.06 10.11,104.75 10.06,102.69 10.06,101.42 10.06,100.15 10.06,98.88 15.52,104.52 15.47,102.46 15.47,101.19 15.47,99.92 15.47,98.65 19.99,104.62 19.94,102.57 19.94,101.3 19.94,100.03 19.94,98.76 15.49,113.92 15.44,111.86 15.44,110.59 15.44,109.32 15.44,108.05 19.76,113.89 19.71,111.84 19.71,110.57 19.71,109.3 19.71,108.03 14.94,59.16 16.99,59.11 18.26,59.11 19.53,59.11 20.8,59.11
  pour Bottom (rank 2): 0.55,139.02 0.55,0.3 37.57,0.3 37.57,139.02
  pour Top: 16.79,0.93 23.95,0.93 23.95,6.69 20.32,6.69 19.91,6.27 19.91,4.56 19.14,3.79 15.12,3.79 15.12,0.95 16.78,0.95
  pour Top: 10.82,8.36 10.82,7.32 11.25,6.88 12.62,6.88 12.62,6.3 8.15,6.3 8.08,6.38 8.08,12.55 16.38,12.55 16.38,9.02 15.8,8.43
  pour Top: 21.01,21.13 21.01,17.37 21.21,17.17 24.31,17.17 24.31,20.35 23.36,21.29
  pour Top: 11.81,43.28 7.98,43.28 7.98,26.67 11.81,26.67
  pour Top: 32.99,39.12 32.69,38.81 32.69,30.61 36.37,30.61 36.55,30.78 36.55,38.43 35.86,39.12
  pour Top: 25.55,124.66 25.55,115.72 27.05,114.22 28.32,114.22 28.32,123.83 27.46,124.69 25.58,124.69
  pour Top: 13.44,2.14 13.44,0.18 23.98,0.18 23.98,4.57 16.02,4.57
  pour Top (rank 2): 3.33,135.81 3.33,14.76 36.96,14.76 36.96,135.81
HOME  (via drill 0.35)
  Top 0.203: IC1.10 16.58,20.41 16.58,19.6 15.08,18.11 v10.85,18.11 | v6.27,125.1 21.69,125.1 23.39,123.4 24.3,123.4 C7.1 24.17,123.42 R5.2
  Bottom 0.203: v10.85,18.11 6.63,22.33 6.63,124.74 v6.27,125.1
IND_LED  (via drill 0.35)
  Top 0.203: R24.1 11.43,60.69 v11.43,55.68 | v19.13,31.14 19.13,28.94 IC1.28
  Top 0.508: R24.1 11.66,64.58 R23.1
  Bottom 0.203: v11.43,55.68 11.43,39.24 19.13,31.55 v19.13,31.14
LFT  (via drill 0.35)  (1 unrouted)
  Top 0.203: IC1.13 18.97,17.21 v18.67,16.92 | v23.62,57.1 23.62,66.24 21.07,68.8 9.71,68.8 v9.63,68.88 | 9.37,78.37 v9.42,78.31 9.48,78.37 7.24,80.61 R8.1 | C10.1 6.35,80.71
  Bottom 0.203: v23.62,57.1 23.62,56.52 23.27,56.16 23.27,29.78 19.1,25.61 19.1,17.35 v18.67,16.92 | v9.63,68.88 9.63,78.11 v9.42,78.31
MF1
  Top 0.203: IC1.2 12.25,26.6 11.58,25.93 8.18,25.93 5.46,28.65 5.46,34.62 6.35,35.51 6.81,35.51 | 6.81,35.51 C16.1 | R14.2 8.16,36.63 7.24,36.63 6.81,36.2 6.81,35.51
MF2
  Top 0.203: IC1.3 12.82,25.8 12.55,25.53 8.05,25.53 4.5,29.08 4.5,46.3 4.65,46.45 6.02,46.45 6.75,45.73 C17.1 6.75,40.59 R15.2
MF3
  Top 0.152: 14.35,23.44 IC1.6
  Top 0.203: 14.35,23.44 9.53,23.44 4.06,28.91 4.06,52.88 5.41,54.23 14.43,54.23 15.44,53.21 C18.1 14.34,51 14.34,49.33 14.35,49.32 14.35,46.18 15.12,45.4 R16.2
MF4
  Top 0.152: 20.55,28.8 IC1.26
  Top 0.203: 20.55,28.8 20.55,30.86 27.09,37.4 R17.2 27.09,41.14 C19.1
MF5
  Top 0.203: IC1.7 9.76,22.6 3.68,28.68 3.68,53.14 5.33,54.79 30.71,54.79 31.85,55.93 33.57,55.93 C20.1 33.44,56.21 R18.2
MUTE  (via drill 0.35)
  Top 0.203: IC1.20 22.54,24 v20.47,24 | C15.1 29.8,90.27 | R13.2 28.23,91.49 29.21,91.49 29.8,90.9 29.8,90.27 | v31.62,87.73 29.8,89.56 29.8,90.27
  Bottom 0.203: v31.62,87.73 31.62,36.42 20.47,25.27 v20.47,24
N$1  (via drill 0.35)
  Top 0.203: SW1.4 SW1.3 13.9,133.61 v13.77,133.48 | R3.1 15.4,117.53 v12.45,117.53
  Bottom 0.203: v12.45,117.53 12.45,132.16 v13.77,133.48
N$2
  Top 0.203: R30.2 17.44,137.31 D1.1
N$3
  Top 0.203: R2.1 16.57,32.16 IC1.31
N$4
  Top 0.203: R4.1 10.37,120.68 12.08,122.38 12.08,123.43 11.07,124.44 3.61,124.44 2.95,125.1 2.95,129.36 3.38,129.8 SW2.3 SW2.4
N$5
  Top 0.203: SW3.4 SW3.3 25.6,129.8 25.27,129.46 25.27,122.42 R5.1
N$6
  Top 0.203: R6.1 14.2,87.06 14.2,84.4 14.67,83.93 SW4.3 16.3,83.93 17.93,82.3 20.95,82.3 SW4.4
N$7
  Top 0.203: SW9.4 31.67,118.61 R11.1 30.85,114.22 SW9.3
N$8
  Top 0.203: SW10.4 SW10.3 31.55,101.7 30.23,101.7 29.27,102.66 R12.1
N$9
  Top 0.203: R7.1 32.13,82.47 34.49,80.11 34.49,78.84 SW5.4 SW5.3
N$10
  Top 0.203: R8.2 8.52,82.71 11.43,79.81 11.43,78.64 SW6.4 9.7,76.91 4.32,76.91 3.68,77.55 3.68,78.09 SW6.3
N$11  (via drill 0.35)
  Top 0.203: R9.1 12.43,70.79 14.44,72.8 SW7.3 15.39,71.56 v15.42,71.53 | v20.98,71.98 21.8,72.8 SW7.4
  Bottom 0.203: v15.42,71.53 20.52,71.53 v20.98,71.98
N$12  (via drill 0.35)
  Top 0.203: SW8.3 15.39,77.18 v15.29,77.09 | R10.1 24.42,74.12 v21.13,74.12 | 22.59,78.46 SW8.4 22.59,78.06 v21.67,77.14
  Bottom 0.203: v21.13,74.12 21.67,74.65 v21.67,77.14 21.62,77.09 v15.29,77.09
N$13
  Top 0.203: SW11.4 31.67,93.01 | 31.67,93.01 SW11.3 | 31.67,93.01 30.99,92.33 30,92.33 29.9,92.43 29.61,92.43 R13.1
N$14  (via drill 0.35)
  Top 0.203: SW12.3 5.46,49.15 v5.49,49.12 | v5.13,45.82 5.13,44.64 5.39,44.38 | 5.39,44.38 SW12.4 | R14.1 5.39,38.82 5.39,44.38
  Bottom 0.203: v5.49,49.12 5.49,46.1 5.2,45.82 v5.13,45.82
N$15  (via drill 0.35)
  Top 0.152: 13.1,44.33 SW13.4
  Top 0.203: SW13.3 13.08,44.35 13.1,44.33 | R15.1 13.79,40.56 v14.25,41.02 | v14.48,44.02 13.37,44.02 SW13.4
  Bottom 0.203: v14.25,41.02 14.25,43.79 v14.48,44.02
N$16
  Top 0.203: R16.1 15.44,47.95 16.55,49.06 16.55,53.07 17.25,53.77 19.86,53.77 20.7,52.93 SW14.3 SW14.4
N$17  (1 unrouted)
  Top 0.203: SW15.4 28.17,44.15 28.17,40.34 R17.1 | SW15.3 28.32,44.32
N$18
  Top 0.203: R18.1 36.6,57.21 36.6,52.16 SW16.3 SW16.4
N$19
  Top 0.203: D1.2 22.84,137.33 IC2.D
N$23  (1 unrouted)
  Top 0.508: R22.2 20.24,67.21 21.31,66.14 21.31,63.73 21.36,63.68
N$24
  Top 0.508: D2.1 15.88,63.63 IC3.D
N$25
  Top 0.203: R26.2 24.57,135.13 IC2.G
N$27
  Top 0.508: R24.2 10.71,65.74 13.28,65.74 13.66,65.36 IC3.G
N$29
  Top 0.203: IC7.G 4.13,10.94 3.45,10.26 3.45,9.63 IC6.6
N$30
  Top 0.305: IC8.G 6.22,11.96 4.37,10.11 IC6.5
N$31
  Top 0.305: IC7.D 5.84,12.86 IC8.D
N$32
  Top 0.508: IC5.4 11.51,1.41 11.78,1.68 C24.1
N$33
  Top 0.508: R27.2 2.2,8.48 4.3,8.48 4.37,8.41 IC6.2
N$35
  Top 0.305: R28.2 7.61,9.91 9.58,9.91 10.59,10.92 C25.1
  Top 0.508: IC6.3 5.32,7.62 R28.2
OK  (via drill 0.35)
  Top 0.203: IC1.15 20.57,16.59 v20.93,16.23 | R10.2 27.24,71.37 26.34,71.37 26.23,71.26 26.23,70.33 | 26.23,70.33 C12.1 | v23.9,71.91 25.48,70.33 26.23,70.33
  Bottom 0.203: v20.93,16.23 19.81,17.35 19.81,25.12 25.02,30.32 25.02,56.9 23.93,57.99 23.93,71.93 v23.9,71.91
PWM  (via drill 0.35)
  Top 0.203: IC1.25 v21.36,30.53 | R25.1 9.18,137.08 R26.1 9.4,135.13 v13.56,130.96
  Bottom 0.203: v21.36,30.53 13.26,38.63 13.26,130.66 v13.56,130.96
PWR  (via drill 0.35)
  Top 0.203: IC1.8 10.86,21.8 v10.77,21.89 | v11.81,120.07 12.37,119.51 15.03,119.51 R3.2 15.03,119.51 C5.1 | v11.73,37.11 11.73,39.04 v12.29,39.6
  Bottom 0.203: v11.81,120.07 11.81,70.87 12.32,70.36 12.32,39.62 v12.29,39.6 | v10.77,21.89 12.15,23.28 12.15,36.69 v11.73,37.11
RGT  (via drill 0.35)
  Top 0.203: IC1.12 18.17,17.96 v17.32,17.12 | v24.97,78.31 24.97,79.83 25.73,80.59 C9.1 R7.2
  Bottom 0.203: v17.32,17.12 18.69,18.49 18.69,25.71 22.91,29.93 22.91,76.25 v24.97,78.31
RX
  Top 0.203: IC1.30 17.37,35.01 16.1,36.27 SV1.1
SWCLK
  Top 0.508: IC1.24 26.67,31.32 J2.4
SWDIO
  Top 0.508: J2.2 27.38,30.05 23.94,26.6 IC1.23
TX
  Top 0.203: SV1.2 18.64,35.51 18.17,35.03 IC1.29
UP  (via drill 0.35)
  Top 0.203: IC1.11 17.37,18.85 16.48,17.96 v16.26,17.96 | v18.39,83.29 15.89,85.79 C8.1 15.89,86.64 R6.2
  Bottom 0.203: v18.39,83.29 18.58,83.1 19.1,83.1 22.56,79.64 22.56,30.07 18.23,25.75 18.23,19.93 v16.26,17.96
USB2_N
  Top 0.406: J3.2 18.59,4.8 18.59,7.38 17.89,8.08 IC9.4
USB2_P
  Top 0.406: IC9.6 19.7,8.85 19.7,8.03 19.23,7.56 J3.3
USB3_N
  Top 0.406: R19.2 30.2,24.19 30.54,24.53 31.75,24.53 33.03,23.25 33.03,17 31.17,15.13 19.52,15.13 17.89,13.5 IC9.3
USB3_P
  Top 0.406: R20.2 30.56,26.68 33.79,23.45 33.79,16.74 31.52,14.47 20.57,14.47 19.79,13.69 IC9.1
USB_N
  Top 0.406: R19.1 26.5,24.15 25.75,24.9 22.85,24.9 IC1.21
USB_P
  Top 0.406: IC1.22 22.8,25.75 25.59,25.75 R20.1
V+  (via drill 0.35)
  Top 0.508: R28.1 7.04,6.43 v6.3,5.69 | IC4.3 10.68,5.02 C23.1 | R22.1 2.38,67.21 v2.31,67.28 2.31,136.8 3.85,138.35 11.01,138.35 R30.1
  Bottom 0.508: v2.31,67.28 2.24,67.21 2.24,12 2.38,11.85 2.38,5.01 3.77,3.62 v3.77,3.58
  other vias: 3.88,2.56 5.09,5.67
  pour Top (rank 2): 2.97,5.13 2.97,2.23 4.45,0.75 11.18,0.75 11.18,6.15 2.93,6.15 2.93,5.74 2.94,5.74
  pour Bottom: 6.85,6.09 6.8,6.04 2.9,6.04 2.9,2.17 3.9,1.16 6.86,1.16 6.86,6.09
V-  (via drill 0.35)
  Top 0.508: IC6.1 3.48,7.18 3.48,5.79 v3.68,5.59 | C25.2 9.38,14.96 v4.75,14.96
  Bottom 0.508: 9.05,10.29 J1.S2 9.43,9.91 3.86,9.91 4.75,10.8 v4.75,14.96 | v3.68,5.59 3.84,5.74 3.84,8.98 J1.S1
  other vias: 3.71,15.6
  pour Top: 3.15,14.99 3.15,13.18 3.68,12.65 4.88,12.65 5.41,13.18 5.41,16.08 5.21,16.28 3.48,16.28 3.15,15.95
  pour Bottom: 2.03,6.78 6.86,6.78 7.54,6.1 7.54,1.57 7.9,1.22 8.49,1.22 8.36,8.99 11.13,8.99 11.25,9.12 11.25,10.46 10.79,10.92 8.81,10.92 8.81,12.24 4.47,16.59 2.03,16.56
VBUS_SENSE  (via drill 0.35)
  Top 0.203: v11.96,21.06 7.14,21.06 R29.1 | v17.68,26.39 18.06,26.39 19.74,28.07 19.74,28.75 IC1.27
  Top 0.508: R29.1 7.04,19.03 R21.2
  Bottom 0.203: v11.96,21.06 12.29,21.39 12.29,22.76 15.88,26.34 17.63,26.34 v17.68,26.39
VOL+  (via drill 0.35)
  Top 0.203: IC1.18 24.74,22.6 24.78,22.56 24.85,22.56 v25.76,21.65 | v29.44,120.35 29.44,118.61 C13.1 26.96,116.13 R11.2
  Bottom 0.203: v25.76,21.65 22.83,21.65 21.1,23.38 21.1,25.4 31.98,36.28 31.98,86.28 33.15,87.45 33.15,116.64 v29.44,120.35
VOL-  (via drill 0.35)  (1 unrouted)
  Top 0.203: IC1.19 24.83,23.4 v25.04,23.19 | v32.84,86.08 32.84,98.29 32.48,98.66 31.55,98.66 27,103.21 27,103.87 | R12.2 28.06,104.93 29.13,104.93 29.4,105.19 C14.1
  Bottom 0.203: v25.04,23.19 22.15,23.19 21.46,23.88 21.46,25.26 32.33,36.13 32.33,85.57 v32.84,86.08